# Altium schematic sheet FMC.SchDoc: FMC ADC 128CH 10B
size 420 x 297 mm; Author: G.Kasprowicz; CompanyName: WUT ISE; DrawnBy: G.Kasprowicz; Organization: WUT ISE; Address1: PW ISE; Address2: Nowowiejska 15/19 00-665 Warsaw; Address3: gkasprow@gmail.com; DocumentNumber: 4; Revision: 1; SheetNumber: 4; SheetTotal: 9; ModifiedBy: -; CheckedDate: -; Title2: FMC; DivGrp: WUT ISE; Designer: G.Kasprowicz; ModifiedDate: -; ProjectName: Sensor Box
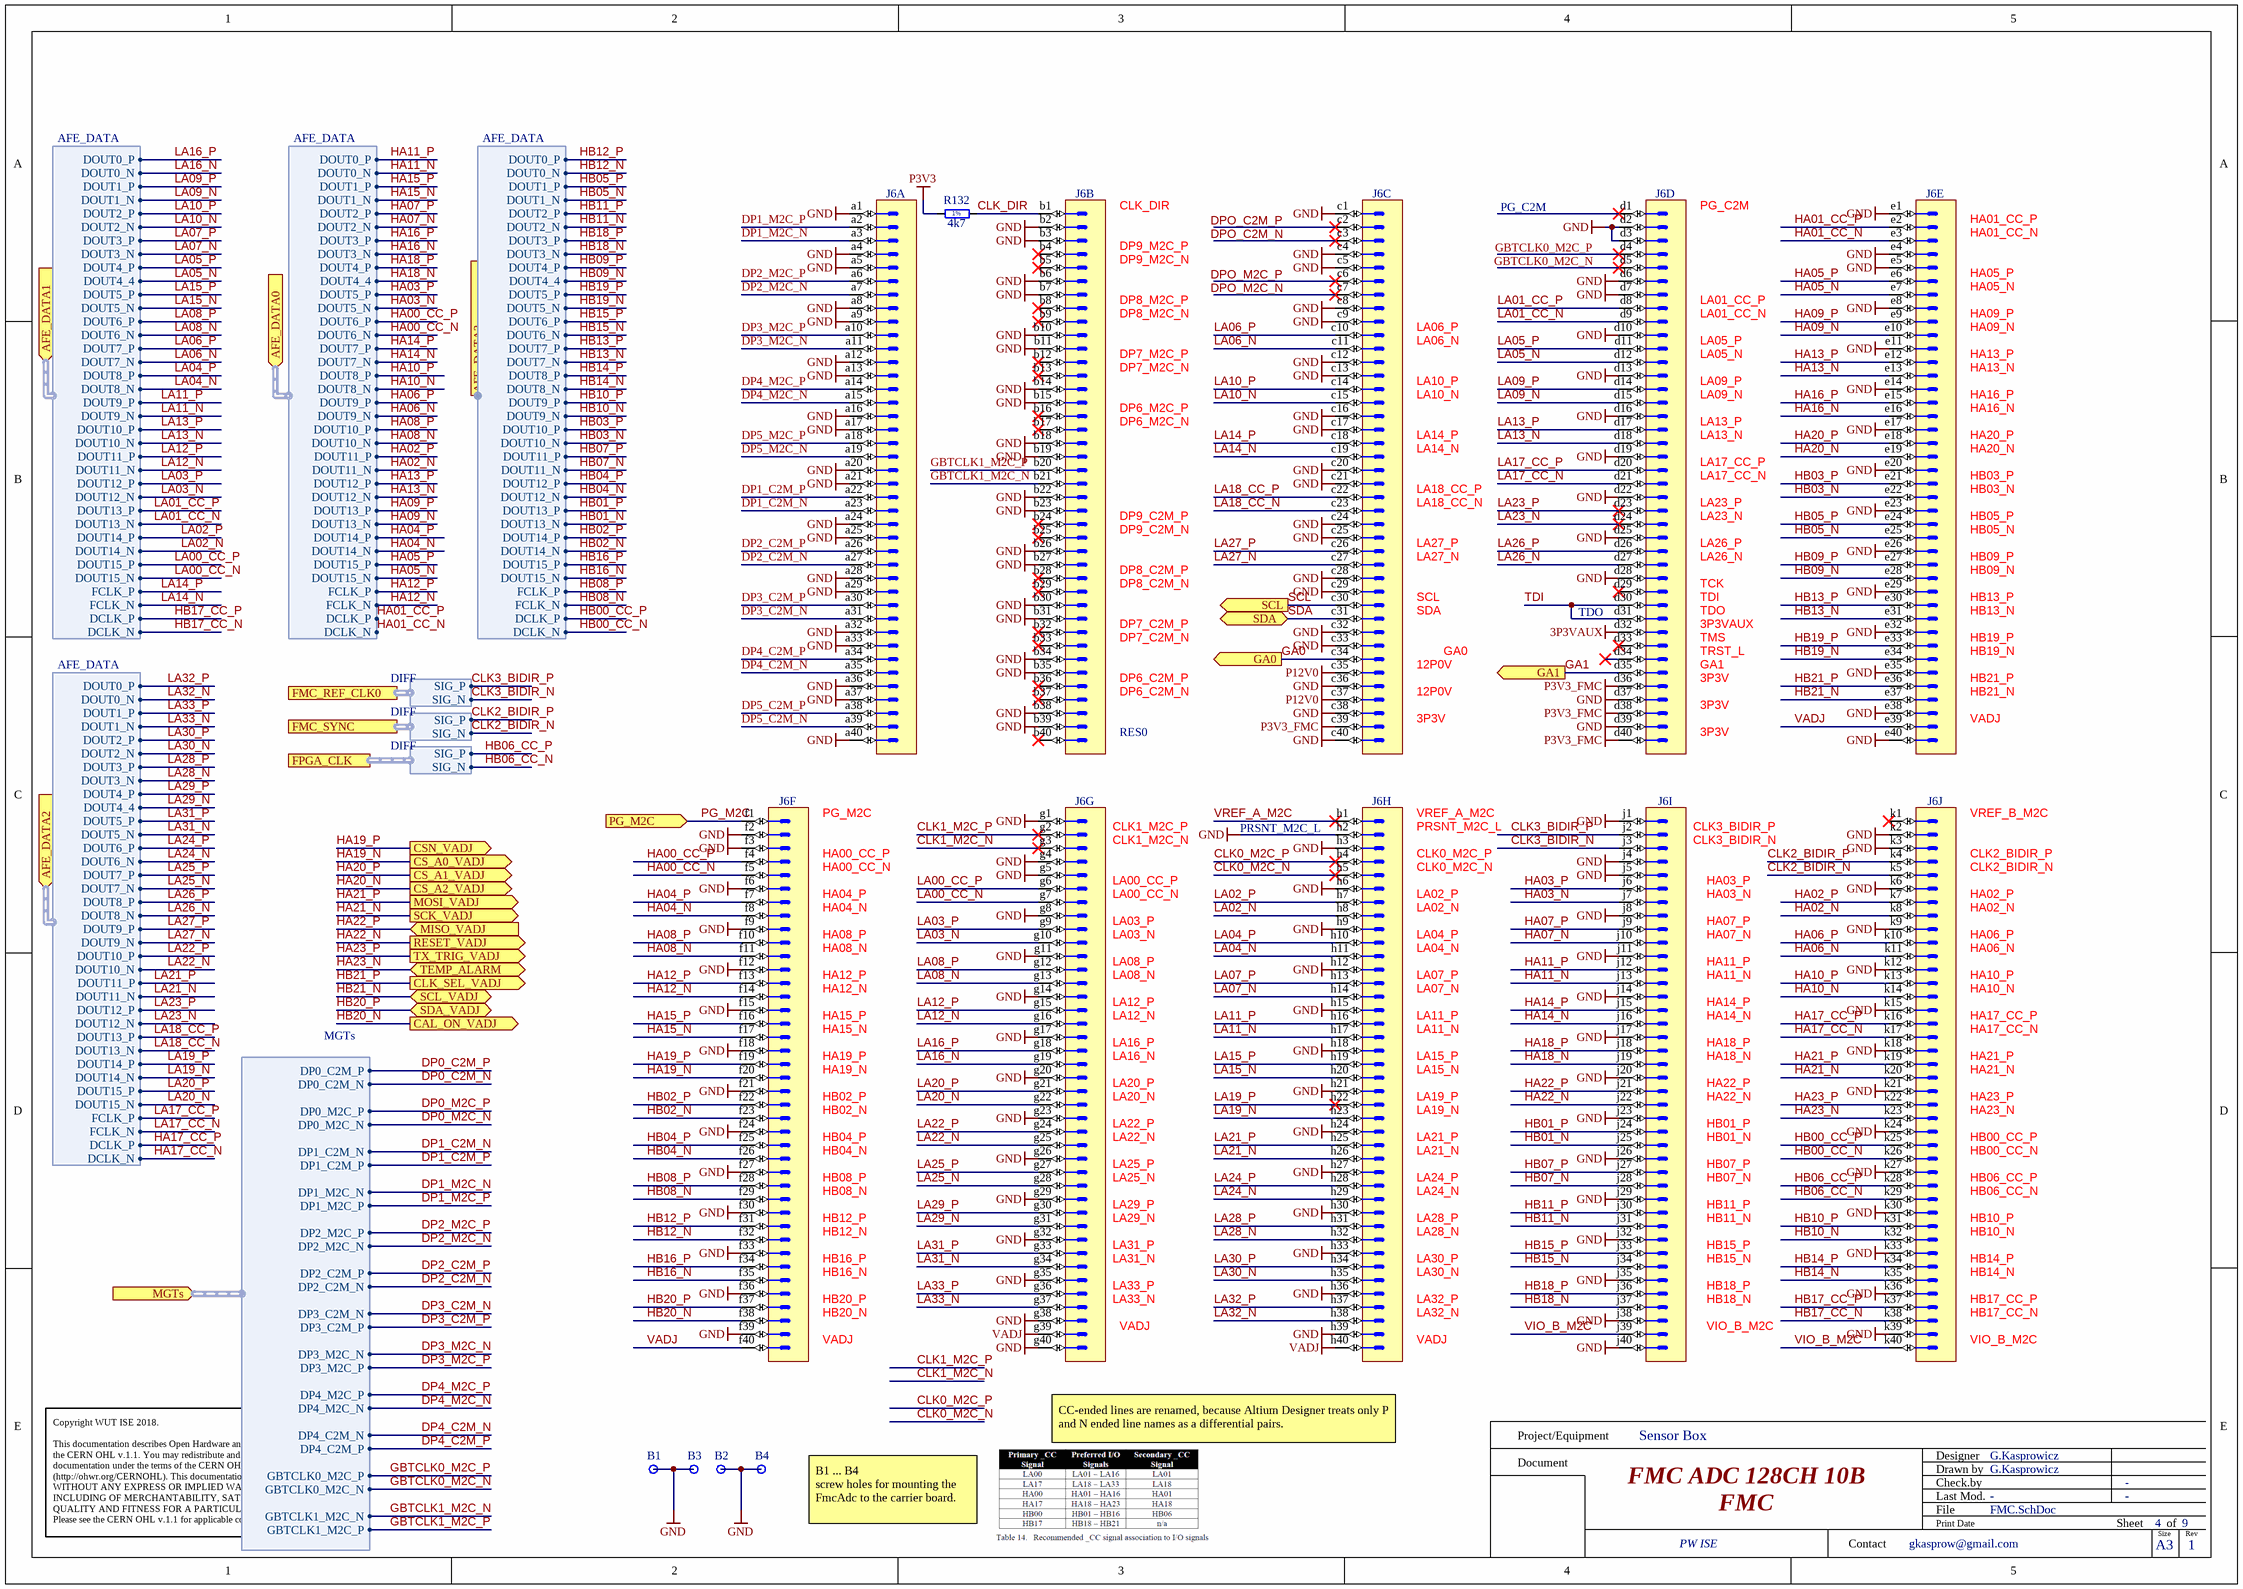
[diagram p0: FMC.SchDoc]

## Parts
B1  Plated Hole  [MTG300_600]  (value not drawn)  (no BOM)
B2  Plated Hole  [MTG300_600]  (value not drawn)  (no BOM)
B3  Plated Hole  [MTG300_600]  (value not drawn)  (no BOM)
B4  Plated Hole  [MTG300_600]  (value not drawn)  (no BOM)
J6  VITA 57  [SAMTEC_ASP-134488-01]  (value not drawn)  (parts A,B,C,D,E,F,G,H,I,J of 10)
R132  4k7  [RESC1608X55N]

## Ports
AFE_DATA0 (in, harness AFE_DATA), AFE_DATA1 (in, harness AFE_DATA), AFE_DATA2 (in, harness AFE_DATA), AFE_DATA3 (harness AFE_DATA), CAL_ON_VADJ (out), CLK_SEL_VADJ (out), CS_A0_VADJ (out), CS_A1_VADJ (out), CS_A2_VADJ (out), CSN_VADJ (out), FMC_REF_CLK0 (harness DIFF), FMC_SYNC (harness DIFF), FPGA_CLK (harness DIFF), GA0 (out), GA1 (out), MGTs (in, harness MGTs), MISO_VADJ (in), MOSI_VADJ (out), PG_M2C (in), RESET_VADJ (out), SCK_VADJ (out), SCL (out), SCL_VADJ (bidir), SDA (bidir), SDA_VADJ (bidir), TEMP_ALARM (bidir), TX_TRIG_VADJ (out)

## Harnesses
DIFF: SIG_P, SIG_N
MGTs: DP0_C2M_P, DP0_M2C_P, DP0_M2C_N, DP1_M2C_N, DP1_M2C_P, DP0_C2M_N, DP1_C2M_N, DP1_C2M_P, DP2_M2C_P, DP2_M2C_N, DP2_C2M_P, DP2_C2M_N, DP3_C2M_N, DP3_C2M_P, DP3_M2C_N, DP3_M2C_P, DP4_M2C_P, DP4_M2C_N, DP4_C2M_N, DP4_C2M_P, GBTCLK0_M2C_P, GBTCLK0_M2C_N, GBTCLK1_M2C_N, GBTCLK1_M2C_P
AFE_DATA: DOUT0_P, DOUT0_N, DOUT1_P, DOUT1_N, DOUT2_P, DOUT2_N, DOUT3_P, DOUT3_N, DOUT4_P, DOUT4_4, DOUT5_P, DOUT5_N, DOUT6_P, DOUT6_N, DOUT7_P, DOUT7_N, DOUT8_P, DOUT8_N, DOUT9_P, DOUT9_N, DOUT10_P, DOUT10_N, DOUT11_P, DOUT11_N, DOUT12_P, DOUT12_N, DOUT13_P, DOUT13_N, DOUT14_P, DOUT14_N, DOUT15_P, DOUT15_N, FCLK_P, FCLK_N, DCLK_P, DCLK_N

## Nets
3P3VAUX: J6.d32
GND: B1.1 B2.1 B3.1 B4.1 J6.a1 J6.a4 J6.a5 J6.a8 J6.a9 J6.a12 J6.a13 J6.a16 J6.a17 J6.a20 J6.a21 J6.a24 J6.a25 J6.a28 J6.a29 J6.a32 J6.a33 J6.a36 J6.a37 J6.a40 J6.b2 J6.b3 J6.b6 J6.b7 J6.b10 J6.b11 J6.b14 J6.b15 J6.b18 J6.b19 J6.b22 J6.b23 J6.b26 J6.b27 J6.b30 J6.b31 J6.b34 J6.b35 J6.b38 J6.b39 J6.c1 J6.c4 J6.c5 J6.c8 J6.c9 J6.c12 J6.c13 J6.c16 J6.c17 J6.c20 J6.c21 J6.c24 J6.c25 J6.c28 J6.c29 J6.c32 J6.c33 J6.c36 J6.c38 J6.c40 J6.d2 J6.d3 J6.d6 J6.d7 J6.d10 J6.d13 J6.d16 J6.d19 J6.d22 J6.d25 J6.d28 J6.d37 J6.d39 J6.e1 J6.e4 J6.e5 J6.e8 J6.e11 J6.e14 J6.e17 J6.e20 J6.e23 J6.e26 J6.e29 J6.e32 J6.e35 J6.e38 J6.e40 J6.f2 J6.f3 J6.f6 J6.f9 J6.f12 J6.f15 J6.f18 J6.f21 J6.f24 J6.f27 J6.f30 J6.f33 J6.f36 J6.f39 J6.g1 J6.g4 J6.g5 J6.g8 J6.g11 J6.g14 J6.g17 J6.g20 J6.g23 J6.g26 J6.g29 J6.g32 J6.g35 J6.g38 J6.g40 J6.h2 J6.h3 J6.h6 J6.h9 J6.h12 J6.h15 J6.h18 J6.h21 J6.h24 J6.h27 J6.h30 J6.h33 J6.h36 J6.h39 J6.j1 J6.j4 J6.j5 J6.j8 J6.j11 J6.j14 J6.j17 J6.j20 J6.j23 J6.j26 J6.j29 J6.j32 J6.j35 J6.j38 J6.j40 J6.k2 J6.k3 J6.k6 J6.k9 J6.k12 J6.k15 J6.k18 J6.k21 J6.k24 J6.k27 J6.k30 J6.k33 J6.k36 J6.k39
P3V3: R132.1
P3V3_FMC: J6.c39 J6.d36 J6.d38 J6.d40
P12V0: J6.c35 J6.c37
VADJ: J6.e39 J6.f40 J6.g39 J6.h40
CLK0_M2C_N: J6.h5
CLK0_M2C_P: J6.h4
CLK1_M2C_N: J6.g3
CLK1_M2C_P: J6.g2
CLK2_BIDIR_N: J6.k5 ; port FMC_SYNC.SIG_N
CLK2_BIDIR_P: J6.k4 ; port FMC_SYNC.SIG_P
CLK3_BIDIR_N: J6.j3 ; port FMC_REF_CLK0.SIG_N
CLK3_BIDIR_P: J6.j2 ; port FMC_REF_CLK0.SIG_P
CLK_DIR: J6.b1 R132.2
DP0_C2M_N: port MGTs.DP0_C2M_N
DP0_C2M_P: port MGTs.DP0_C2M_P
DP0_M2C_N: port MGTs.DP0_M2C_N
DP0_M2C_P: port MGTs.DP0_M2C_P
DP1_C2M_N: J6.a23 ; port MGTs.DP1_C2M_N
DP1_C2M_P: J6.a22 ; port MGTs.DP1_C2M_P
DP1_M2C_N: J6.a3 ; port MGTs.DP1_M2C_N
DP1_M2C_P: J6.a2 ; port MGTs.DP1_M2C_P
DP2_C2M_N: J6.a27 ; port MGTs.DP2_C2M_N
DP2_C2M_P: J6.a26 ; port MGTs.DP2_C2M_P
DP2_M2C_N: J6.a7 ; port MGTs.DP2_M2C_N
DP2_M2C_P: J6.a6 ; port MGTs.DP2_M2C_P
DP3_C2M_N: J6.a31 ; port MGTs.DP3_C2M_N
DP3_C2M_P: J6.a30 ; port MGTs.DP3_C2M_P
DP3_M2C_N: J6.a11 ; port MGTs.DP3_M2C_N
DP3_M2C_P: J6.a10 ; port MGTs.DP3_M2C_P
DP4_C2M_N: J6.a35 ; port MGTs.DP4_C2M_N
DP4_C2M_P: J6.a34 ; port MGTs.DP4_C2M_P
DP4_M2C_N: J6.a15 ; port MGTs.DP4_M2C_N
DP4_M2C_P: J6.a14 ; port MGTs.DP4_M2C_P
DP5_C2M_N: J6.a39
DP5_C2M_P: J6.a38
DP5_M2C_N: J6.a19
DP5_M2C_P: J6.a18
GA0: J6.c34 ; port GA0
GA1: J6.d35 ; port GA1
GBTCLK0_M2C_N: port MGTs.GBTCLK0_M2C_N
GBTCLK0_M2C_P: port MGTs.GBTCLK0_M2C_P
GBTCLK1_M2C_N: J6.b21 ; port MGTs.GBTCLK1_M2C_N
GBTCLK1_M2C_P: J6.b20 ; port MGTs.GBTCLK1_M2C_P
HA00_CC_N: J6.f5 ; port AFE_DATA0.DOUT6_N
HA00_CC_P: J6.f4 ; port AFE_DATA0.DOUT6_P
HA01_CC_N: J6.e3 ; port AFE_DATA0.DCLK_N
HA01_CC_P: J6.e2 ; port AFE_DATA0.DCLK_P
HA02_N: J6.k8 ; port AFE_DATA0.DOUT11_N
HA02_P: J6.k7 ; port AFE_DATA0.DOUT11_P
HA03_N: J6.j7 ; port AFE_DATA0.DOUT5_N
HA03_P: J6.j6 ; port AFE_DATA0.DOUT5_P
HA04_N: J6.f8 ; port AFE_DATA0.DOUT14_N
HA04_P: J6.f7 ; port AFE_DATA0.DOUT14_P
HA05_N: J6.e7 ; port AFE_DATA0.DOUT15_N
HA05_P: J6.e6 ; port AFE_DATA0.DOUT15_P
HA06_N: J6.k11 ; port AFE_DATA0.DOUT9_N
HA06_P: J6.k10 ; port AFE_DATA0.DOUT9_P
HA07_N: J6.j10 ; port AFE_DATA0.DOUT2_N
HA07_P: J6.j9 ; port AFE_DATA0.DOUT2_P
HA08_N: J6.f11 ; port AFE_DATA0.DOUT10_N
HA08_P: J6.f10 ; port AFE_DATA0.DOUT10_P
HA09_N: J6.e10 ; port AFE_DATA0.DOUT13_N
HA09_P: J6.e9 ; port AFE_DATA0.DOUT13_P
HA10_N: J6.k14 ; port AFE_DATA0.DOUT8_N
HA10_P: J6.k13 ; port AFE_DATA0.DOUT8_P
HA11_N: J6.j13 ; port AFE_DATA0.DOUT0_N
HA11_P: J6.j12 ; port AFE_DATA0.DOUT0_P
HA12_N: J6.f14 ; port AFE_DATA0.FCLK_N
HA12_P: J6.f13 ; port AFE_DATA0.FCLK_P
HA13_N: J6.e13 ; port AFE_DATA0.DOUT12_N
HA13_P: J6.e12 ; port AFE_DATA0.DOUT12_P
HA14_N: J6.j16 ; port AFE_DATA0.DOUT7_N
HA14_P: J6.j15 ; port AFE_DATA0.DOUT7_P
HA15_N: J6.f17 ; port AFE_DATA0.DOUT1_N
HA15_P: J6.f16 ; port AFE_DATA0.DOUT1_P
HA16_N: J6.e16 ; port AFE_DATA0.DOUT3_N
HA16_P: J6.e15 ; port AFE_DATA0.DOUT3_P
HA17_CC_N: J6.k17 ; port AFE_DATA2.DCLK_N
HA17_CC_P: J6.k16 ; port AFE_DATA2.DCLK_P
HA18_N: J6.j19 ; port AFE_DATA0.DOUT4_4
HA18_P: J6.j18 ; port AFE_DATA0.DOUT4_P
HA19_N: J6.f20 ; port CS_A0_VADJ
HA19_P: J6.f19 ; port CSN_VADJ
HA20_N: J6.e19 ; port CS_A2_VADJ
HA20_P: J6.e18 ; port CS_A1_VADJ
HA21_N: J6.k20 ; port SCK_VADJ
HA21_P: J6.k19 ; port MOSI_VADJ
HA22_N: J6.j22 ; port RESET_VADJ
HA22_P: J6.j21 ; port MISO_VADJ
HA23_N: J6.k23 ; port TEMP_ALARM
HA23_P: J6.k22 ; port TX_TRIG_VADJ
HB00_CC_N: J6.k26 ; port AFE_DATA3.DCLK_N
HB00_CC_P: J6.k25 ; port AFE_DATA3.DCLK_P
HB01_N: J6.j25 ; port AFE_DATA3.DOUT13_N
HB01_P: J6.j24 ; port AFE_DATA3.DOUT13_P
HB02_N: J6.f23 ; port AFE_DATA3.DOUT14_N
HB02_P: J6.f22 ; port AFE_DATA3.DOUT14_P
HB03_N: J6.e22 ; port AFE_DATA3.DOUT10_N
HB03_P: J6.e21 ; port AFE_DATA3.DOUT10_P
HB04_N: J6.f26 ; port AFE_DATA3.DOUT12_N
HB04_P: J6.f25 ; port AFE_DATA3.DOUT12_P
HB05_N: J6.e25 ; port AFE_DATA3.DOUT1_N
HB05_P: J6.e24 ; port AFE_DATA3.DOUT1_P
HB06_CC_N: J6.k29 ; port FPGA_CLK.SIG_N
HB06_CC_P: J6.k28 ; port FPGA_CLK.SIG_P
HB07_N: J6.j28 ; port AFE_DATA3.DOUT11_N
HB07_P: J6.j27 ; port AFE_DATA3.DOUT11_P
HB08_N: J6.f29 ; port AFE_DATA3.FCLK_N
HB08_P: J6.f28 ; port AFE_DATA3.FCLK_P
HB09_N: J6.e28 ; port AFE_DATA3.DOUT4_4
HB09_P: J6.e27 ; port AFE_DATA3.DOUT4_P
HB10_N: J6.k32 ; port AFE_DATA3.DOUT9_N
HB10_P: J6.k31 ; port AFE_DATA3.DOUT9_P
HB11_N: J6.j31 ; port AFE_DATA3.DOUT2_N
HB11_P: J6.j30 ; port AFE_DATA3.DOUT2_P
HB12_N: J6.f32 ; port AFE_DATA3.DOUT0_N
HB12_P: J6.f31 ; port AFE_DATA3.DOUT0_P
HB13_N: J6.e31 ; port AFE_DATA3.DOUT7_N
HB13_P: J6.e30 ; port AFE_DATA3.DOUT7_P
HB14_N: J6.k35 ; port AFE_DATA3.DOUT8_N
HB14_P: J6.k34 ; port AFE_DATA3.DOUT8_P
HB15_N: J6.j34 ; port AFE_DATA3.DOUT6_N
HB15_P: J6.j33 ; port AFE_DATA3.DOUT6_P
HB16_N: J6.f35 ; port AFE_DATA3.DOUT15_N
HB16_P: J6.f34 ; port AFE_DATA3.DOUT15_P
HB17_CC_N: J6.k38 ; port AFE_DATA1.DCLK_N
HB17_CC_P: J6.k37 ; port AFE_DATA1.DCLK_P
HB18_N: J6.j37 ; port AFE_DATA3.DOUT3_N
HB18_P: J6.j36 ; port AFE_DATA3.DOUT3_P
HB19_N: J6.e34 ; port AFE_DATA3.DOUT5_N
HB19_P: J6.e33 ; port AFE_DATA3.DOUT5_P
HB20_N: J6.f38 ; port CAL_ON_VADJ
HB20_P: J6.f37 ; port SDA_VADJ
HB21_N: J6.e37 ; port SCL_VADJ
HB21_P: J6.e36 ; port CLK_SEL_VADJ
LA00_CC_N: J6.g7 ; port AFE_DATA1.DOUT15_N
LA00_CC_P: J6.g6 ; port AFE_DATA1.DOUT15_P
LA01_CC_N: J6.d9 ; port AFE_DATA1.DOUT13_N
LA01_CC_P: J6.d8 ; port AFE_DATA1.DOUT13_P
LA02_N: J6.h8 ; port AFE_DATA1.DOUT14_N
LA02_P: J6.h7 ; port AFE_DATA1.DOUT14_P
LA03_N: J6.g10 ; port AFE_DATA1.DOUT12_N
LA03_P: J6.g9 ; port AFE_DATA1.DOUT12_P
LA04_N: J6.h11 ; port AFE_DATA1.DOUT8_N
LA04_P: J6.h10 ; port AFE_DATA1.DOUT8_P
LA05_N: J6.d12 ; port AFE_DATA1.DOUT4_4
LA05_P: J6.d11 ; port AFE_DATA1.DOUT4_P
LA06_N: J6.c11 ; port AFE_DATA1.DOUT7_N
LA06_P: J6.c10 ; port AFE_DATA1.DOUT7_P
LA07_N: J6.h14 ; port AFE_DATA1.DOUT3_N
LA07_P: J6.h13 ; port AFE_DATA1.DOUT3_P
LA08_N: J6.g13 ; port AFE_DATA1.DOUT6_N
LA08_P: J6.g12 ; port AFE_DATA1.DOUT6_P
LA09_N: J6.d15 ; port AFE_DATA1.DOUT1_N
LA09_P: J6.d14 ; port AFE_DATA1.DOUT1_P
LA10_N: J6.c15 ; port AFE_DATA1.DOUT2_N
LA10_P: J6.c14 ; port AFE_DATA1.DOUT2_P
LA11_N: J6.h17 ; port AFE_DATA1.DOUT9_N
LA11_P: J6.h16 ; port AFE_DATA1.DOUT9_P
LA12_N: J6.g16 ; port AFE_DATA1.DOUT11_N
LA12_P: J6.g15 ; port AFE_DATA1.DOUT11_P
LA13_N: J6.d18 ; port AFE_DATA1.DOUT10_N
LA13_P: J6.d17 ; port AFE_DATA1.DOUT10_P
LA14_N: J6.c19 ; port AFE_DATA1.FCLK_N
LA14_P: J6.c18 ; port AFE_DATA1.FCLK_P
LA15_N: J6.h20 ; port AFE_DATA1.DOUT5_N
LA15_P: J6.h19 ; port AFE_DATA1.DOUT5_P
LA16_N: J6.g19 ; port AFE_DATA1.DOUT0_N
LA16_P: J6.g18 ; port AFE_DATA1.DOUT0_P
LA17_CC_N: J6.d21 ; port AFE_DATA2.FCLK_N
LA17_CC_P: J6.d20 ; port AFE_DATA2.FCLK_P
LA18_CC_N: J6.c23 ; port AFE_DATA2.DOUT13_N
LA18_CC_P: J6.c22 ; port AFE_DATA2.DOUT13_P
LA19_N: J6.h23 ; port AFE_DATA2.DOUT14_N
LA19_P: J6.h22 ; port AFE_DATA2.DOUT14_P
LA20_N: J6.g22 ; port AFE_DATA2.DOUT15_N
LA20_P: J6.g21 ; port AFE_DATA2.DOUT15_P
LA21_N: J6.h26 ; port AFE_DATA2.DOUT11_N
LA21_P: J6.h25 ; port AFE_DATA2.DOUT11_P
LA22_N: J6.g25 ; port AFE_DATA2.DOUT10_N
LA22_P: J6.g24 ; port AFE_DATA2.DOUT10_P
LA23_N: J6.d24 ; port AFE_DATA2.DOUT12_N
LA23_P: J6.d23 ; port AFE_DATA2.DOUT12_P
LA24_N: J6.h29 ; port AFE_DATA2.DOUT6_N
LA24_P: J6.h28 ; port AFE_DATA2.DOUT6_P
LA25_N: J6.g28 ; port AFE_DATA2.DOUT7_N
LA25_P: J6.g27 ; port AFE_DATA2.DOUT7_P
LA26_N: J6.d27 ; port AFE_DATA2.DOUT8_N
LA26_P: J6.d26 ; port AFE_DATA2.DOUT8_P
LA27_N: J6.c27 ; port AFE_DATA2.DOUT9_N
LA27_P: J6.c26 ; port AFE_DATA2.DOUT9_P
LA28_N: J6.h32 ; port AFE_DATA2.DOUT3_N
LA28_P: J6.h31 ; port AFE_DATA2.DOUT3_P
LA29_N: J6.g31 ; port AFE_DATA2.DOUT4_4
LA29_P: J6.g30 ; port AFE_DATA2.DOUT4_P
LA30_N: J6.h35 ; port AFE_DATA2.DOUT2_N
LA30_P: J6.h34 ; port AFE_DATA2.DOUT2_P
LA31_N: J6.g34 ; port AFE_DATA2.DOUT5_N
LA31_P: J6.g33 ; port AFE_DATA2.DOUT5_P
LA32_N: J6.h38 ; port AFE_DATA2.DOUT0_N
LA32_P: J6.h37 ; port AFE_DATA2.DOUT0_P
LA33_N: J6.g37 ; port AFE_DATA2.DOUT1_N
LA33_P: J6.g36 ; port AFE_DATA2.DOUT1_P
PG_M2C: J6.f1 ; port PG_M2C
SCL: J6.c30 ; port SCL
SDA: J6.c31 ; port SDA
TDI: J6.d30 J6.d31
VIO_B_M2C: J6.j39 J6.k40
VREF_A_M2C: J6.h1

Not connected (* = marked no-connect by the designer): J6 b4* b5* b8* b9* b12* b13* b16* b17* b24* b25* b28* b29* b32* b33* b36* b37* b40* c2* c3* c6* c7* d1* d4* d5* d29* d33* d34* k1*

## Notes on the sheet
- CLK_DIR
- DP9_M2C_P
- DP9_M2C_N
- DPO_C2M_P
- DPO_C2M_N
- PG_C2M
- GBTCLK0_M2C_P
- GBTCLK0_M2C_N
- HA01_CC_P
- HA01_CC_N
- DP8_M2C_P
- DP8_M2C_N
- DPO_M2C_P
- DPO_M2C_N
- LA01_CC_P
- LA01_CC_N
- HA05_P
- HA05_N
- HA09_P
- DP7_M2C_P
- DP7_M2C_N
- LA06_P
- LA06_N
- LA10_P
- LA10_N
- LA05_P
- LA05_N
- LA09_P
- LA09_N
- HA09_N
- HA13_P
- HA13_N
- HA16_P
- DP6_M2C_P
- DP6_M2C_N
- LA14_P
- LA14_N
- LA13_P
- LA13_N
- HA16_N
- HA20_P
- HA20_N
- DP9_C2M_P
- DP9_C2M_N
- LA18_CC_P
- LA18_CC_N
- LA17_CC_P
- LA17_CC_N
- LA23_P
- LA23_N
- HB03_P
- HB03_N
- HB05_P
- HB05_N
- DP8_C2M_P
- DP8_C2M_N
- LA27_P
- LA27_N
- LA26_P
- LA26_N
- TCK
- HB09_P
- HB09_N
- DP7_C2M_P
- DP7_C2M_N
- SCL
- SDA
- 12P0V
- GA0
- (near J6) TDO
- TDI
- TDO
- 3P3VAUX
- TMS
- TRST_L
- GA1
- HB13_P
- HB13_N
- HB19_P
- HB19_N
- DP6_C2M_P
- DP6_C2M_N
- 3P3V
- HB21_P
- HB21_N
- VADJ
- RES0
- PG_M2C
- HA00_CC_P
- (near J6) CLK1_M2C_P
- (near J6) CLK1_M2C_N
- (near J6) PRSNT_M2C_L
- VREF_A_M2C
- PRSNT_M2C_L
- CLK0_M2C_P
- (near J6) CLK3_BIDIR_P
- (near J6) CLK3_BIDIR_N
- VREF_B_M2C
- CLK2_BIDIR_P
- HA00_CC_N
- HA04_P
- HA04_N
- HA08_P
- (near J6) LA00_CC_P
- (near J6) LA00_CC_N
- (near J6) LA03_P
- (near J6) LA03_N
- CLK0_M2C_N
- LA02_P
- LA02_N
- LA04_P
- HA03_P
- HA03_N
- HA07_P
- HA07_N
- CLK2_BIDIR_N
- HA02_P
- HA02_N
- HA06_P
- HA08_N
- HA12_P
- HA12_N
- (near J6) LA08_P
- (near J6) LA08_N
- LA04_N
- LA07_P
- LA07_N
- HA11_P
- HA11_N
- HA06_N
- HA10_P
- HA10_N
- HA15_P
- HA15_N
- HA19_P
- HA19_N
- (near J6) LA12_P
- (near J6) LA12_N
- (near J6) LA16_P
- (near J6) LA16_N
- LA11_P
- LA11_N
- LA15_P
- LA15_N
- HA14_P
- HA14_N
- HA18_P
- HA18_N
- HA17_CC_P
- HA17_CC_N
- HA21_P
- HA21_N
- HB02_P
- HB02_N
- (near J6) LA20_P
- (near J6) LA20_N
- (near J6) LA22_P
- LA19_P
- LA19_N
- HA22_P
- HA22_N
- HB01_P
- HA23_P
- HA23_N
- HB04_P
- HB04_N
- HB08_P
- HB08_N
- (near J6) LA22_N
- (near J6) LA25_P
- (near J6) LA25_N
- (near J6) LA29_P
- LA21_P
- LA21_N
- LA24_P
- LA24_N
- HB01_N
- HB07_P
- HB07_N
- HB11_P
- HB00_CC_P
- HB00_CC_N
- HB06_CC_P
- HB06_CC_N
- HB12_P
- HB12_N
- HB16_P
- (near J6) LA29_N
- (near J6) LA31_P
- (near J6) LA31_N
- LA28_P
- LA28_N
- LA30_P
- HB11_N
- HB15_P
- HB15_N
- HB10_P
- HB10_N
- HB14_P
- HB16_N
- HB20_P
- HB20_N
- (near J6) LA33_P
- (near J6) LA33_N
- LA30_N
- LA32_P
- LA32_N
- HB18_P
- HB18_N
- VIO_B_M2C
- HB14_N
- HB17_CC_P
- HB17_CC_N
- (near J6) CC-ended lines are renamed, because Altium Designer treats only P and N ended line names as a differential pairs.
- (near B4) B1 ... B4
  screw holes for mounting the FmcAdc to the carrier board.
- Project/Equipment
- Document
- Designer
- Drawn by
- Check.by
- Copyright WUT ISE 2018.
  This documentation describes Open Hardware and is licensed under the CERN OHL v.1.1. You may redistribute and modify this documentation under the terms of the CERN OHL v.1.1. (http://ohwr.org/CERNOHL). This documentation is distributed WITHOUT ANY EXPRESS OR IMPLIED WARRANTY, INCLUDING OF MERCHANTABILITY, SATISFACTORY QUALITY AND FITNESS FOR A PARTICULAR PURPOSE. Please see the CERN OHL v.1.1 for applicable conditions.
- Contact
- File
- Last Mod.
- Print Date
- Sheet
- Size
- A3
- of
- Rev
- (in symbol R0603_4K7_1%_0.1W_100PPM) 1%

## Library data of the parts
B1-B4 = PLATED_HOLE3.0_PAD6.0: Single Terminal Socket; Part Description: Plated Through Hole: Hole Dia.=3.0mm Pad Dia.=6.0mm; Mounted: No; Table: Pads; Part Number: PLATED_HOLE3.0_PAD6.0; Component Type: Standard (No BOM); Designator: Single Terminal Socket; Library Reference: Single Terminal Socket; Pin Count: 1; Family: Plated Hole; Socket: No; SMD: No; Status: None; ComponentHeight: 0mm; Author: CERN DEM JLC; CreateDate: 26.05.2008; LatestRevisionDate: 26.05.2008; PackageDescription: Plated Through Hole: Hole Dia.=3.0mm Pad Dia.=6.0mm
J6 = SAMTEC_ASP-134488-01: Connector VITA 57, 400 Male contacts in 10 row abcdefghj; Part Description: 400 contacts (10 rows abcdefghj) Surface Mount Male Connector, VITA 57 (MC-HPC-10); Manufacturer: SAMTEC; Part Number: SAMTEC_ASP-134488-01; Component Kind: Standard; Component Type: Standard; Pin Count: 400; Family: VITA 57; Mounted: Yes; Socket: No; SMD: Yes; Status: None; Manufacturer Part Number: ASP-134488-01; ComponentHeight: 6.1mm; HelpURL: \\cern.ch\dfs\Applications\Altium\Datasheets\SAMTEC_ASP-134488-01.pdf; Author: CERN DEM JLC; CreateDate: 30/04/2009; LatestRevisionDate: 17/08/2009; Table: SAMTEC
R132 = R0603_4K7_1%_0.1W_100PPM: Resistor - 1%; Part Description: General Purpose Thick Film Chip Resistor; Manufacturer: GENERIC; Manufacturer1 Part Number: NRC06F4701TRF; Power: 0.1W; TC: ±100ppm/°C; Table: Resistors SMD; Part Number: R0603_4K7_1%_0.1W_100PPM; Component Kind: Standard; Component Type: Standard; Pin Count: 2; Value: 4k7; Status: Preferred; Tolerance: ±1%; Manufacturer Part Number: R0603_4K7_1%_0.1W_100PPM; Case: 0603; Mounted: Yes; Socket: No; SMD: Yes; Manufacturer1 Example: NIC COMPONENT; Manufacturer1 ComponentHeight: 0.55mm; HelpURL: \\cern.ch\dfs\Applications\Altium\Datasheets\R0603_NIC_NRC.pdf; Author: CERN DEM JLC; CreateDate: 03/12/2007; LatestRevisionDate: 13/03/2008